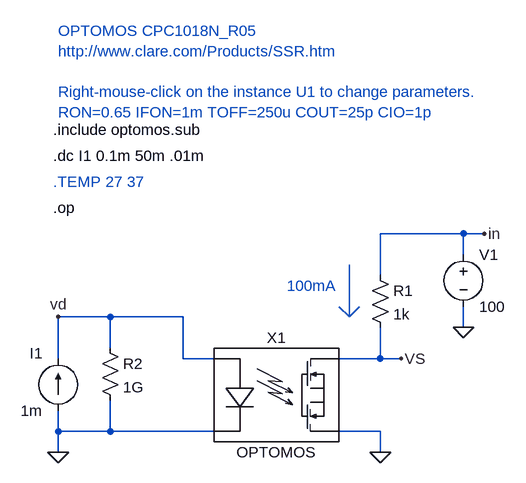
[diagram p0: schematic optomos_cr_test1.asc]
optomos_cr_test1.asc, the LTspice schematic file:
Version 4
SHEET 1 2328 1460
WIRE 720 176 592 176
WIRE 752 176 720 176
WIRE 720 208 720 176
WIRE 592 240 592 176
WIRE 176 304 96 304
WIRE 288 304 176 304
WIRE 720 320 720 288
WIRE 176 352 176 304
WIRE 96 368 96 304
WIRE 288 368 288 304
WIRE 336 368 288 368
WIRE 592 368 592 320
WIRE 592 368 528 368
WIRE 624 368 592 368
WIRE 96 480 96 448
WIRE 176 480 176 432
WIRE 176 480 96 480
WIRE 336 480 176 480
WIRE 592 480 528 480
WIRE 96 512 96 480
WIRE 592 512 592 480
FLAG 720 320 0
FLAG 96 512 0
FLAG 592 512 0
FLAG 752 176 in
FLAG 96 304 vd
FLAG 624 368 VS
SYMBOL voltage 720 192 R0
SYMATTR InstName V1
SYMATTR Value 100
SYMBOL current 96 448 R180
WINDOW 0 24 88 Left 0
WINDOW 3 24 0 Left 0
WINDOW 123 0 0 Left 0
WINDOW 39 0 0 Left 0
SYMATTR InstName I1
SYMATTR Value 1m
SYMBOL res 160 336 R0
SYMATTR InstName R2
SYMATTR Value 1G
SYMBOL optomos 432 432 R0
SYMATTR InstName X1
SYMBOL res 576 224 R0
SYMATTR InstName R1
SYMATTR Value 1k
TEXT 88 56 Left 0 !.dc I1 0.1m 50m .01m
TEXT 88 136 Left 0 !.op
TEXT 88 96 Left 0 ;.TEMP 27 37
TEXT 96 -136 Left 0 ;OPTOMOS CPC1018N_R05\nhttp://www.clare.com/Products/SSR.htm\n \nRight-mouse-click on the instance U1 to change parameters.\nRON=0.65 IFON=1m TOFF=250u COUT=25p CIO=1p
TEXT 88 16 Left 0 !.include optomos.sub
TEXT 448 256 Left 0 ;100mA
LINE Normal 544 304 544 224
LINE Normal 560 288 544 304
LINE Normal 544 304 560 288
LINE Normal 528 288 544 304
LINE Normal 528 288 528 288

The netlist it stands for:
* optomos_cr_test1.asc
V1 in 0 100
I1 0 vd 1m
R2 vd 0 1G
XX1 vd 0 0 VS OPTOMOS RON=0.65 IFON=1m TOFF=250u COUT=25p CIO=1p  ; pins A K D1 D2
R1 in VS 1k
.dc I1 0.1m 50m .01m
.op
* .TEMP 27 37
* OPTOMOS CPC1018N_R05
* http://www.clare.com/Products/SSR.htm
* Right-mouse-click on the instance U1 to change parameters.
* RON=0.65 IFON=1m TOFF=250u COUT=25p CIO=1p
.include optomos.sub
* 100mA
.backanno
.end